# Altium schematic sheet MecaVac.SchDoc: Controle e Refrigeração de Vacinas
size A4; Author: Gabriel Canela; CompanyName: Mecatron; SheetNumber: 1; SheetTotal: 1; SPICEModelCacheDENAQWJC: <root> / <DocumentId>DENAQWJC</DocumentId> / <CacheFrame Number="0"> / <Model Name="1n4007" Kind="MDL"> / <Text>*1N4007 MCE 8-16-95 / *1000V 1A Si GenPurpose Diode pkg:DIODE0.4 1,2 / .MODEL 1N4007 D(IS=2.55E-9 RS=0.042 N=1.75 TT=5.76E-6 CJO=1.85E-11 / + VJ=0.75 M=0.333 BV=1000 IBV=9.86E-5 )</Text> / </Model> / <Model Name="fuse" Kind="CKT"> / <Text>.SUBCKT FUSE 1 2 PARAMS: CURRENT=1 RESISTANCE=1m / SW1 1 2 3 0 SMOD OFF / BNLV 3 0 V=(abs(v(1,2))) / .MODEL SMOD SW (VT={(CURRENT*RESISTANCE)} RON=1g ROFF={RESISTANCE}) / .ENDS FUSE</Text> / </Model> / </CacheFrame> / </root>
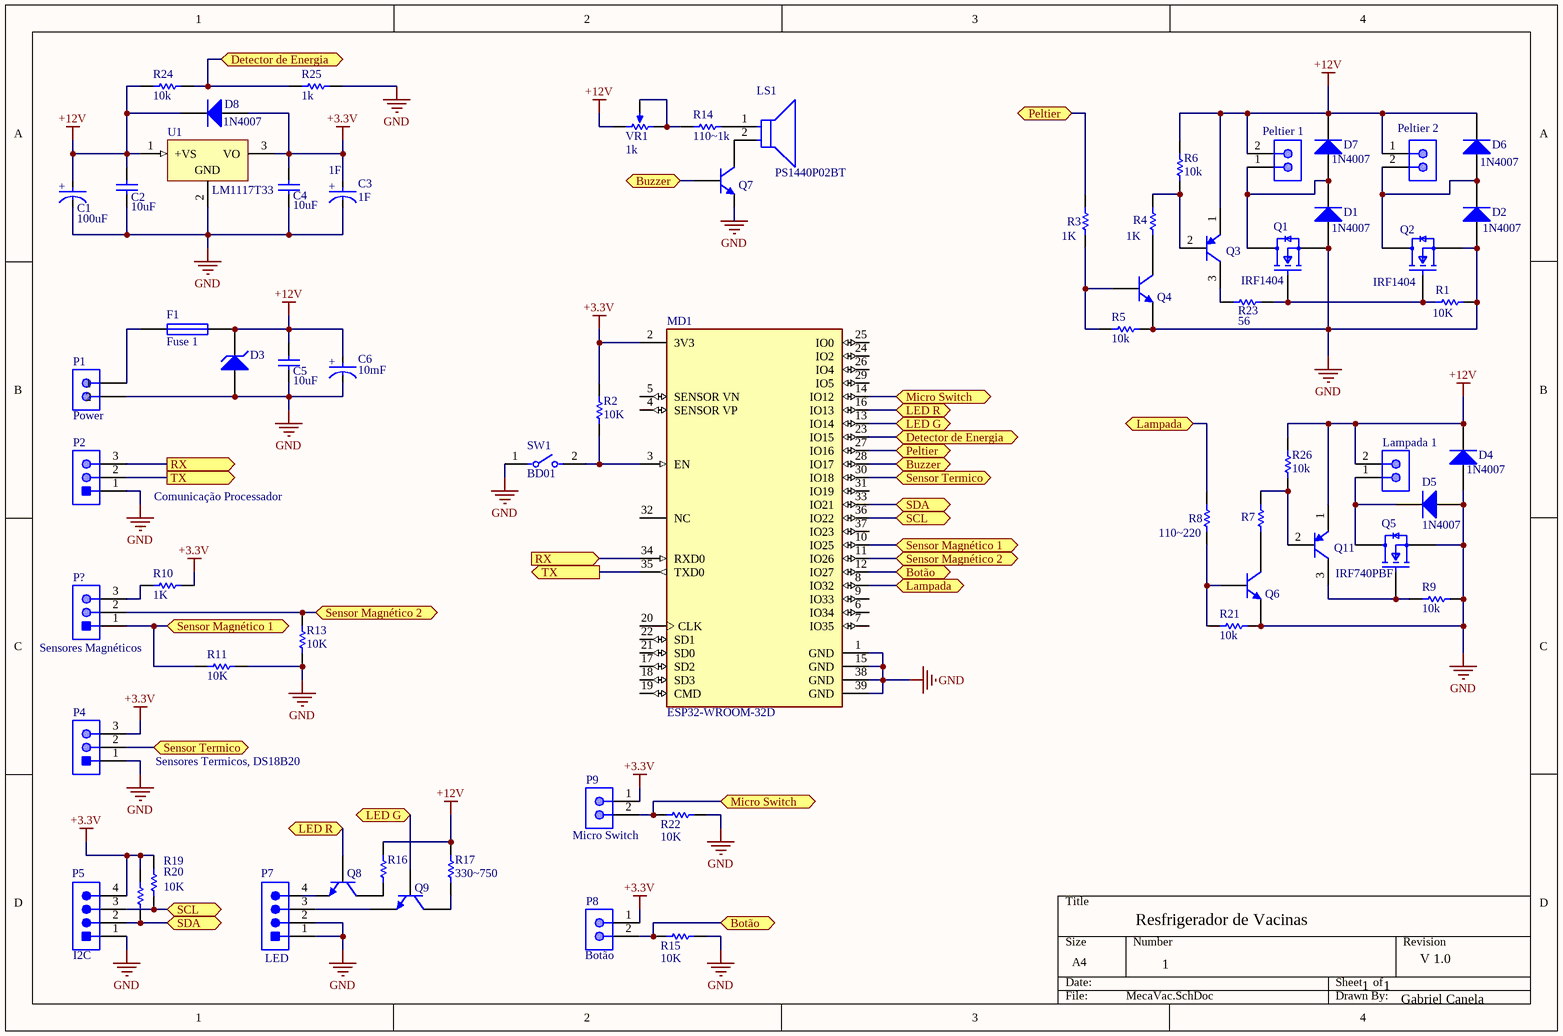
[diagram p0: MecaVac.SchDoc]

## Parts
C1  100uF  [FP-RAD-TH-D_8_0_5-L_11_5-MFG]
C2  10uF  [VISH-K104K15X7RF5TL2]
C3  1F  [FP-FR0H105ZF-MFG]
C4  10uF  [VISH-K104K15X7RF5TL2]
C5  10uF  [VISH-K104K15X7RF5TL2]
C6  10mF  [FP-RAD-TH-D_16_0_5-L_25_2-MFG]
D1  1N4007  [DO-41]
D2  1N4007  [DO-41]
D3  P6KE200A  [ONSC-SURMETIC40-2-017AA-01]  (value not drawn)
D4  1N4007  [DO-41]
D5  1N4007  [DO-41]
D6  1N4007  [DO-41]
D7  1N4007  [DO-41]
D8  1N4007  [DO-41]
F1  Fuse 1  [PIN-W2/E2.8]
Lampada_1  22-27-2021  [MOLX-22-27-2021_V]  (value not drawn)
LS1  PS1440P02BT  [FP-PS1440P02BT-MFG]
MD1  ESP32-WROOM-32D  [FP-ESP32-WROOM-32D-MFG]
P1  Power  [MOLX-22-27-2021_V]
P2  Comunicação Processador  [MOLX-22-27-2031_V]
P4  Sensores Termicos, DS18B20  [MOLX-22-27-2031_V]
P5  I2C  [MOLX-22-27-2041_V]
P7  LED  [MOLX-22-27-2041_V]
P8  Botão  [MOLX-22-27-2021_V]
P9  Micro Switch  [MOLX-22-27-2021_V]
P?  Sensores Magnéticos  [MOLX-22-27-2031_V]
Peltier_1  22-27-2021  [MOLX-22-27-2021_V]  (value not drawn)
Peltier_2  22-27-2021  [MOLX-22-27-2021_V]  (value not drawn)
Q1  IRF1404  [FP-X15-0364-MFG]
Q2  IRF1404  [FP-X15-0364-MFG]
Q3  MPSA56RLRAG  [ONSC-TO-92-3-29-11_AM_BL]  (value not drawn)
Q4  BC546BZL1G  [ONSC-TO-92-3-29-11_AM_BL]  (value not drawn)
Q5  IRF740PBF  [FP-X15-0364-MFG]
Q6  BC546BZL1G  [ONSC-TO-92-3-29-11_AM_BL]  (value not drawn)
Q7  BC546BZL1G  [ONSC-TO-92-3-29-11_AM_BL]  (value not drawn)
Q8  BC546BZL1G  [ONSC-TO-92-3-29-11_AM_BL]  (value not drawn)
Q9  BC546BZL1G  [ONSC-TO-92-3-29-11_AM_BL]  (value not drawn)
Q11  MPSA56RLRAG  [ONSC-TO-92-3-29-11_AM_BL]  (value not drawn)
R1  value 10K  [AXIAL-0.3]  (hidden comment: Res1)
R2  value 10K  [AXIAL-0.3]  (hidden comment: Res1)
R3  value 1K  [AXIAL-0.3]  (hidden comment: Res1)
R4  value 1K  [AXIAL-0.3]  (hidden comment: Res1)
R5  value 10k  [AXIAL-0.3]  (hidden comment: Res1)
R6  value 10k  [AXIAL-0.3]  (hidden comment: Res1)
R7  Res1  [AXIAL-0.3]  (value not drawn)
R8  value 110~220  [AXIAL-0.3]  (hidden comment: Res1)
R9  value 10k  [AXIAL-0.3]  (hidden comment: Res1)
R10  value 1K  [AXIAL-0.3]  (hidden comment: Res1)
R11  value 10K  [AXIAL-0.3]  (hidden comment: Res1)
R13  value 10K  [AXIAL-0.3]  (hidden comment: Res1)
R14  value 110~1k  [AXIAL-0.3]  (hidden comment: Res1)
R15  value 10K  [AXIAL-0.3]  (hidden comment: Res1)
R16  Res1  [AXIAL-0.3]  (value not drawn)
R17  value 330~750  [AXIAL-0.3]  (hidden comment: Res1)
R19  Res1  [AXIAL-0.3]  (value not drawn)
R20  value 10K  [AXIAL-0.3]  (hidden comment: Res1)
R21  value 10k  [AXIAL-0.3]  (hidden comment: Res1)
R22  value 10K  [AXIAL-0.3]  (hidden comment: Res1)
R23  value 56  [AXIAL-0.3]  (hidden comment: Res1)
R24  value 10k  [AXIAL-0.3]  (hidden comment: Res1)
R25  value 1k  [AXIAL-0.3]  (hidden comment: Res1)
R26  value 10k  [AXIAL-0.3]  (hidden comment: Res1)
SW1  BD01  [FP-BD01-MFG]
U1  LM1117T33  [NEB0003A]
VR1  1k  [BOUR-3362P]

## Ports
Botão (bidir, see MecaVac[2D]), Botão (bidir, see MecaVac[3C]), Buzzer (bidir, see MecaVac[2A]), Buzzer (bidir, see MecaVac[3B]), Detector de Energia (bidir, see MecaVac[1A]), Detector de Energia (bidir, see MecaVac[3B]), Lampada (bidir, see MecaVac[3B]), Lampada (bidir, see MecaVac[3C]), LED G (bidir, see MecaVac[1D]), LED G (bidir, see MecaVac[3B]), LED R (bidir, see MecaVac[1D]), LED R (bidir, see MecaVac[3B]), Micro Switch (bidir, see MecaVac[2D]), Micro Switch (bidir, see MecaVac[3B]), Peltier (bidir, see MecaVac[3A]), Peltier (bidir, see MecaVac[3B]), RX (in, see MecaVac[1B]), RX (out, see MecaVac[2C]), SCL (bidir, see MecaVac[1D]), SCL (bidir, see MecaVac[3C]), SDA (bidir, see MecaVac[1D]), SDA (bidir, see MecaVac[3B]), Sensor Magnético 1 (bidir, see MecaVac[1C]), Sensor Magnético 1 (bidir, see MecaVac[3C]), Sensor Magnético 2 (bidir, see MecaVac[1C]), Sensor Magnético 2 (bidir, see MecaVac[3C]), Sensor Termico (bidir, see MecaVac[1C]), Sensor Termico (bidir, see MecaVac[3B]), TX (out, see MecaVac[1B]), TX (out, see MecaVac[2C])

## Nets
+3.3V: C3.2(A) C4.2 D8.1(A) MD1.2(3V3) P4.3 P5.4 P8.1 P9.1 R2.2 R10.1 R19.2 R20.2 U1.3(VO)
+12V: C1.2(A) C2.2 C5.2 C6.2(A) D3.1(K) D4.2(K) D6.2(K) D7.2(K) D8.2(K) F1.1 Lampada_1.2 Peltier_1.2 Peltier_2.1 Q3.1(E) Q11.1(E) R6.2 R16.1 R17.1 R24.2 R26.2 U1.1(+VS) VR1.3(CW)
GND: C1.1(C) C2.1 C3.1(C) C4.1 C5.1 C6.1(C) D1.1(A) D2.1(A) D3.2(A) D4.1(A) D5.1(A) MD1.1(GND) MD1.15(GND) MD1.38(GND) MD1.39(GND) P1.2 P2.1 P4.1 P5.1 P7.1 P7.2 Q1.3(S) Q2.3(S) Q4.3(E) Q5.3(S) Q6.3(E) Q7.3(E) R1.2 R5.2 R9.1 R11.1 R13.2 R15.1 R21.2 R22.1 R25.1 SW1.1 U1.2(GND)
Botão: MD1.12(IO27) P8.2 R15.2 ; port Botão
Buzzer: MD1.28(IO17) Q7.2(B) ; port Buzzer
Detector de Energia: MD1.23(IO15) R24.1 R25.2 ; port Detector de Energia
Lampada: MD1.8(IO32) R8.2 ; port Lampada
LED G: MD1.13(IO14) Q9.2(B) ; port LED G
LED R: MD1.16(IO13) Q8.2(B) ; port LED R
Micro Switch: MD1.14(IO12) P9.2 R22.2 ; port Micro Switch
Peltier: MD1.27(IO16) R3.2 ; port Peltier
RX: MD1.34(RXD0) P2.3 ; port RX
SCL: MD1.36(IO22) P5.3 R20.1 ; port SCL
SDA: MD1.33(IO21) P5.2 R19.1 ; port SDA
Sensor Magnético 1: MD1.10(IO25) P?.1 R11.2 ; port Sensor Magnético 1
Sensor Magnético 2: MD1.11(IO26) P?.2 R13.1 ; port Sensor Magnético 2
Sensor Termico: MD1.30(IO18) P4.2 ; port Sensor Termico
TX: MD1.35(TXD0) P2.2 ; port TX
NetD1_2: D1.2(K) D7.1(A) Peltier_1.1 Q1.2(D)
NetD2_2: D2.2(K) D6.1(A) Peltier_2.2 Q2.2(D)
NetD5_2: D5.2(K) Lampada_1.1 Q5.2(D)
NetF1_2: F1.2 P1.1
NetLS1_1: LS1.1 R14.1
NetLS1_2: LS1.2 Q7.1(C)
NetMD1_3: MD1.3(EN) R2.1 SW1.2
NetP7_3: P7.3 Q9.3(E)
NetP7_4: P7.4 Q8.3(E)
NetP?_3: P?.3 R10.2
NetQ1_1: Q1.1(G) Q2.1(G) R1.1 R23.2
NetQ3_2: Q3.2(B) R4.2 R6.1
NetQ3_3: Q3.3(C) R23.1
NetQ4_1: Q4.1(C) R4.1
NetQ4_2: Q4.2(B) R3.1 R5.1
NetQ5_1: Q5.1(G) Q11.3(C) R9.2
NetQ6_1: Q6.1(C) R7.1
NetQ6_2: Q6.2(B) R8.1 R21.1
NetQ8_1: Q8.1(C) R16.2
NetQ9_1: Q9.1(C) R17.2
NetQ11_2: Q11.2(B) R7.2 R26.1
NetR14_2: R14.2 VR1.1(CCW) VR1.2(S)

Not connected (* = marked no-connect by the designer): MD1 4(SENSOR_VP) 5(SENSOR_VN) 6(IO34) 7(IO35) 9(IO33) 17(SD2) 18(SD3) 19(CMD) 20(CLK) 21(SD0) 22(SD1) 24(IO2) 25(IO0) 26(IO4) 29(IO5) 31(IO19) 32(NC) 37(IO23)

## Notes on the sheet
- Resfrigerador de Vacinas
- 1
- V 1.0
- Gabriel Canela
- (in symbol CMP-03024-000003-1) +
- (in symbol CMP-05427-001264-1) +
- (in symbol CMP-05427-001523-1) +

## Library data of the parts
C1 = CMP-05427-001264-1: Aluminum Electrolytic Capacitors (Radial Lead Type) AEC-Q200 Qualified 120uF ±20% 35V; Lead Diameter: 0.6mm; Leakage Current: 3uA; Polarity: Polar; Ripple Current: 555mA; Life (Hours): 2000Hour; Tolerance: 10%; Impedance: 117mR; Height - Seated (Max): 0.453inch; Max Operating Temperature: 105°C; REACH SVHC: No SVHC; Construction: RADIAL; Diameter: 8mm; Length: 11.5mm; Capacitance: 120uF; Contact Plating: Tin; Min Operating Temperature: -55°C; Height: 11.5mm; Package Quantity: 200; Termination: Radial; Voltage Rating: 35V; Voltage Rating (DC): 35V; Lead Free: Lead Free; Case/Package: Radial; Packaging: Bulk; Radiation Hardening: No; Voltage: 35V; ESR (Equivalent Series Resistance): 117mR; Number of Pins: 2; Series: FC; RoHS Compliant: Yes; Mount: Through Hole; Lead Pitch: 3.5mm; Ripple Current (AC): 555mA
C2 C4 C5 = CMP-2000-06508-1: Ceramic Capacitor, 100 nF, +/- 10%, 50 V, -55 to 125 degC, 2-Pin THD, RoHS, Tape and Reel; Manufacturer: Vishay; Other Names: BC1084CT; Catalog Drawings: Mono-KapSide2-15_5.58Mono-KapSide1_15; Temperature Coefficient: X7R; Voltage - Rated: 50V; Online Catalog: Mono-Kap™Series; Capacitance: 0.1µF; Size / Dimension: 0.157"Lx0.098"W(4.00mmx2.50mm); Operating Temperature: -55°C~125°C; Family: CeramicCapacitors; Manufacturer URL: http://www.vishay.com/; Standard Package: 1; Thickness (Max): -; Ratings: -; Datasheet Version: 08/2013; Package Description: 2-Pin Through Hole Device, Body 4 x 2.6 mm; Mounting Type: ThroughHole; Features: -; Lead Spacing: 0.098"(2.50mm); Tolerance: ±10%; Category: Capacitors; Mounting Technology: ThroughHole; Lead Style: Straight; Datasheet URL: http://www.vishay.com/docs/45171/kseries.pdf; Applications: GeneralPurpose; Package / Case: Radial; Height - Seated (Max): 0.220"(5.58mm); Package Reference: K104K15X7RF5TL2; Series: Mono-Kap™K; Packaging: CutTape(CT)
C3 = CMP-03024-000003-1: CAP 1F -20% +80% 5.5V T/H; Manufacturer: KEMET; Manufacturer Part Number: FR0H105ZF; Tolerance: -20/+80%; Digikey Description: CAP 1F -20% +80% 5.5V T/H; Device Class L1: Passive Components; Device Class L3: Supercapacitors; ComponentLink2URL: https://content.kemet.com/datasheets/KEM_S6016_FR.pdf; Value: 1F; RoHS: TRUE; Mouser Description: Supercapacitors / Ultracapacitors 1F 5.5volts Radial Super Cap; Octopart: https://octopart.com/fr0h105zf-kemet-30531656; Voltage Rating: 5.5V; Device Class L2: Capacitors; Package: FR0H105ZF; Temperature: -40°C to +85°C; Temperature Range High: +85°C; Automotive: No; Capacitance: 1F; Temperature Range Low: -40°C; ComponentLink2Description: Datasheet; Category: Cap; Height: 22mm; Lead Free: Yes
C6 = CMP-05427-001523-1: Aluminum Electrolytic Capacitors (Radial Lead Type) AEC-Q200 Qualified 10000uF ±20% 10V; Lead Diameter: 0.8mm; Life (Hours): 2000Hour; Lead/Base Style: Straight; Ripple Current: 1.89A; Voltage Rating: 10V; Series: HD; Case/Package: Radial; Max Operating Temperature: 105°C; Tolerance: 20%; Construction: RADIAL; REACH SVHC: No SVHC; Lead Pitch: 7.5mm; Voltage Rating (DC): 10V; RoHS Compliant: Yes; Packaging: Bulk; Voltage: 10V; Height: 25mm; Termination: Radial; Ripple Current (AC): 1.89A; Min Operating Temperature: -55°C; Diameter: 16mm; Height - Seated (Max): 1.063inch; Capacitance: 10mF; Length: 25mm; Package Quantity: 100; Mount: Through Hole
D1 D2 D4-D8 = Diode 1N4007: 1 Amp General Purpose Rectifier; Published: 8-Jun-2000; LatestRevisionDate: 17-Jul-2002; LatestRevisionNote: Re-released for DXP Platform.; DatasheetVersion: 1998; PackageVersion: Aug-1999; PackageReference: DO-41; Publisher: Altium Limited; PackageDescription: Diode, Axial; Body 5.2 x 2.7 mm (LxDia. max), Lead Dia. 0.86 mm (max); Code_JEDEC: DO-204-AL; ComponentLink1Description: Manufacturer Link; ComponentLink1URL: http://www.fairchildsemi.com/; ComponentLink2Description: Datasheet; ComponentLink2URL: http://www.fairchildsemi.com/ds/1N%2F1N4001.pdf
D3 = CMP-1061-00677-1: 600 W Peak Power Transient Voltage Suppressor, 2-Pin Surmetic(TM) 40, Bulk Box; Manufacturer: On Semiconductor; IR Max (uA): 5; V(BR) Typ (V): 200; Direction: Unidirectional; PPK Max (W): 600; ComponentLink3URL: http://www.onsemi.cn/pub_link/Collateral/017AA.PDF; PackageReference: SURMETIC40-2-017AA-01; ComponentLink1Description: Manufacturer URL; ComponentLink2URL: http://www.onsemi.com/pub_link/Collateral/P6KE6.8A-D.PDF; ComponentLink1URL: http://www.onsemi.com/; PackageDescription: 2-Pin, Axial Lead, Diameter 3.49 mm; DatasheetVersion: Rev. 10; PackageVersion: Rev. O, 09/2005; PartNumber: P6KE200A; ComponentLink3Description: Package Specification; ComponentLink2Description: Datasheet; Mounting Technology: Through Hole; Packing: Bulk Box
F1 = Fuse 1: Fuse; Published: 8-Jun-2000; LatestRevisionDate: 17-Jul-2002; LatestRevisionNote: Re-released for DXP Platform.; PackageReference: PIN-W2/E2.8; Publisher: Altium Limited; PackageDescription: Thru-Hole; 2 Leads
Lampada_1 P1 P8 P9 Peltier_1 Peltier_2 = CMP-2000-05537-1: Male Header, Pitch 2.54 mm, 1 x 2 Position, Height 11.7 mm, Tail Length 3.56 mm, 0 to 75 degC, RoHS, Bulk; Manufacturer: Molex; PartNumber: 0022272021; Current rating: 4A; Package Version: Rev. BC, 02/2012; Voltage rating: 250V; No. of Positions: 2; Pitch: 2.54mm; No. of Rows: 1; Orientation: Vertical; Operating temperature: 0°Cto+75°C; Manufacturer URL: http://www.molex.com/; Mounting Technology: ThroughHole; Housing material: Nylon(UL94V-0); Package Description: 2-Leads Header, Body 5.08 x 5.8 mm, Pitch 2.54 mm; Voltage - Max: 250V; Datasheet URL: http://www.molex.com/pdm_docs/sd/022272021_sd.pdf; Package Reference: 22-27-2021; Contact material: Tinplatedbrass; Current - Max: 4A; Datasheet Version: Rev. F, 06/2009
LS1 = CMP-08413-000003-1: AUDIO PIEZO TRANSDUCER 30V TH; Self Resonant Frequency: 4kHz; Washable: No; Voltage Rating (DC): 3V; Number of Terminals/Pins: 2; Packaging: Tape and Reel; Lead Free: Lead Free; Min Operating Temperature: -10°C; Package Quantity: 350; Termination: PC Pins; Mount: Through Hole; Max Operating Temperature: 70°C; Operating Supply Voltage: 3V; Diameter: 14mm; RoHS Compliant: Yes; Frequency: 4kHz; Height: 8mm
MD1 = CMP-194065-000003-1: WIFI MODULE 32MBITS SPI FLASH; Manufacturer: Espressif Systems; Max Supply Voltage: 3.6V; Nominal Supply Current: 500mA; Max Frequency: 2484MHz; Number Of Adc Channels: 16; Number Of Gpio: 32; Interface: I2C,SPI,UART,Ethernet,I2S,Other; Data Rate: 150Mbits/s; Min Supply Voltage: 3V; Bandwidth: 72MHz; Sensitivity: -98dBm; Octopart: https://octopart.com/esp32-wroom-32d-espressif+systems-91040050; Package: ESP32-WROOM-32D; ComponentLink2URL: https://www.espressif.com/sites/default/files/documentation/esp32-wroom-32d_esp32-wroom-32u_datasheet_en.pdf; Lead Free: Yes; Category: UNK; Mouser Description: Wi-Fi/BT BLE Module ESP32-D0WD, SPI Flash, UART, P; Device Class L1: Integrated Circuits (ICs); RoHS: TRUE; Temperature Range Low: -40°C; ComponentLink2Description: Datasheet; Digikey Description: WIFI MODULE 32MBITS SPI FLASH; Height: 3.2mm; Temperature: -40°C to +85°C; Manufacturer Part Number: ESP32-WROOM-32D; Device Class L3: Transceivers; Device Class L2: RF Semiconductors and Devices; Temperature Range High: +85°C; Automotive: No
P2 P4 P? = CMP-2000-05538-1: Male Header, Pitch 2.54 mm, 1 x 3 Position, Height 11.7 mm, Tail Length 3.56 mm, -40 to 80 degC, RoHS, Bulk; Manufacturer: Molex; Voltage rating: 250V; Current rating: 4A; Package Reference: 22-27-2031; Housing material: Nylon(UL94V-0); Operating temperature: 0°Cto+75°C; Package Description: Male Header, Pitch 2.54 mm, 1 x 3 Position, Height 11.7 mm, Tail Length 3.56 mm; Package URL: http://www.molex.com/pdm_docs/sd/022272031_sd.pdf; Datasheet Version: 06/2016; Manufacturer URL: http://www.molex.com/; Mounting Technology: ThroughHole; Datasheet URL: http://www.molex.com/webdocs/datasheets/pdf/en-us/0022272031_PCB_HEADERS.pdf; Contact material: Tinplatedbrass
P5 P7 = CMP-2000-05243-1: Male Header, Pitch 2.54 mm, 1 x 4 Position, Height 11.7 mm, Tail Length 3.56 mm, RoHS, Bulk; Manufacturer: Molex; Voltage rating: 250V; Current rating: 4A; Datasheet Version: Rev. F, 06/2009; Operating temperature: 0degCto+75degC; Contact material: Tinplatedbrass; Manufacturer URL: http://www.molex.com/; Housing material: Nylon(UL94V-0); Datasheet URL: http://www.molex.com/pdm_docs/sd/022272041_sd.pdf
Q1 Q2 = CMP-02550-000088-1: MOSFET N-CH 400V 10A TO-220AB; Manufacturer Part Number: IRF740PBF; Manufacturer: Vishay; Power Dissipation: 125W; Turn On Delay Time: 14ns; Standoff Height: 3.33mm; Max Junction Temp: +150°C; Number Of Channels: 1; Reverse Recovery Charge: 3800nC; Turn Off Delay Time: 50ns; Threshold Vgs Min: 2V; Input Capacitace At Vds: 1400pF @ 25V; Depletion Mode: False; Gate Charge At Vgs: 63nC @ 10V; Rthja Max: 62°C/W; Threshold Vgs Max: 4V; Gate To Source Voltage: 20V; Pulse Drain Current: 40A; Reverse Recovery Time: 370ns; Drain To Source Resistance: 0.55Ω; Temperature Range Low: -55°C; Mouser Description: MOSFET N-Chan 400V 10 Amp; Package: X15-0364; RoHS: TRUE; Category: Trans; Drain To Source Voltage: 400V; Drain To Source Breakdown Voltage: 400V; Device Class L3: MOSFETs; Lead Free: Yes; Height: 19.89mm; Continuous Drain Current: 10A; Octopart: https://octopart.com/irf740pbf-vishay-46527100; Automotive: No; Max Forward Diode Voltage: 2V; Device Class L1: Discrete Semiconductors; ComponentLink2URL: http://www.vishay.com/docs/91054/91054.pdf; Temperature Range High: +150°C; Device Class L2: Transistors; ComponentLink2Description: Datasheet; Temperature: -55°C to +150°C; Number Of N Channels: 1; Digikey Description: MOSFET N-CH 400V 10A TO-220AB
Q3 Q11 = CMP-1048-01494-1: 80 V, 0.5 A, Amplifier Transistor, PNP Transistor, 3-Pin TO-92, Pb-Free, Tape and Reel; Manufacturer: On Semiconductor; fT Min (MHz): 50; IC Continuous (A): 0.5; ComponentLink2Description: Datasheet; Polarity: PNP; Packing: Tape and Reel; Mounting Technology: Through Hole; DatasheetVersion: Rev. 3; ComponentLink1Description: Manufacturer URL; ComponentLink1URL: http://www.onsemi.com/; RoHS: TRUE; PackageVersion: Rev. AM; PackageDescription: 3-Pin Transistor Outline, Body 4.825 x 3.685 mm, Pitch 1.27 mm; PartNumber: MPSA56RLRAG; ComponentLink3Description: Package Specification; ComponentLink3URL: http://www.onsemi.com/pub_link/Collateral/MAC97-D.PDF; PackageReference: TO-92-3-29-11_AM_BL; ComponentLink2URL: http://www.onsemi.cn/pub_link/Collateral/MPSA05-D.PDF
Q4 Q6-Q9 = CMP-1048-01594-1: Amplifier Transistor, NPN Silicon, 3-Pin TO-92, Pb-Free, Ammo Box; Manufacturer: On Semiconductor; IC Continuous (A): 0.1; fT Min (MHz): 150; PartNumber: BC546BZL1G; PackageVersion: Rev. AM; ComponentLink2Description: Datasheet; Packing: Ammo Box; ComponentLink1URL: http://www.onsemi.com/; ComponentLink3Description: Package Specification; ComponentLink2URL: http://www.onsemi.com/pub_link/Collateral/BC546-D.PDF; Mounting Technology: Through Hole; DatasheetVersion: Rev. 7; RoHS: TRUE; Polarity: NPN; ComponentLink1Description: Manufacturer URL; ComponentLink3URL: http://www.onsemi.com/pub_link/Collateral/MAC97-D.PDF; PackageDescription: 3-Pin Transistor Outline, Body 4.825 x 3.685 mm, Pitch 1.27 mm; PackageReference: TO-92-3-29-11_AM_BL
Q5 = CMP-02550-000088-1: MOSFET N-CH 400V 10A TO-220AB; Manufacturer: Vishay; Power Dissipation: 125W; Turn On Delay Time: 14ns; Standoff Height: 3.33mm; Max Junction Temp: +150°C; Number Of Channels: 1; Reverse Recovery Charge: 3800nC; Turn Off Delay Time: 50ns; Threshold Vgs Min: 2V; Input Capacitace At Vds: 1400pF @ 25V; Depletion Mode: False; Gate Charge At Vgs: 63nC @ 10V; Rthja Max: 62°C/W; Threshold Vgs Max: 4V; Gate To Source Voltage: 20V; Pulse Drain Current: 40A; Reverse Recovery Time: 370ns; Drain To Source Resistance: 0.55Ω; Temperature Range Low: -55°C; Mouser Description: MOSFET N-Chan 400V 10 Amp; Package: X15-0364; RoHS: TRUE; Manufacturer Part Number: IRF740PBF; Category: Trans; Drain To Source Voltage: 400V; Drain To Source Breakdown Voltage: 400V; Device Class L3: MOSFETs; Lead Free: Yes; Height: 19.89mm; Continuous Drain Current: 10A; Octopart: https://octopart.com/irf740pbf-vishay-46527100; Automotive: No; Max Forward Diode Voltage: 2V; Device Class L1: Discrete Semiconductors; ComponentLink2URL: http://www.vishay.com/docs/91054/91054.pdf; Temperature Range High: +150°C; Device Class L2: Transistors; ComponentLink2Description: Datasheet; Temperature: -55°C to +150°C; Number Of N Channels: 1; Digikey Description: MOSFET N-CH 400V 10A TO-220AB
R1-R6 R8-R11 R13-R15 R17 R20-R26 = Res1: Resistor; Published: 8-Jun-2000; LatestRevisionDate: 17-Jul-2002; LatestRevisionNote: Re-released for DXP Platform.; PackageReference: AXIAL-0.3; Publisher: Altium Limited; PackageDescription: Axial Device, Thru-Hole; 2 Leads; 0.3 in Pin Spacing
R7 = Res1: Resistor; Value: 110~220; Published: 8-Jun-2000; LatestRevisionDate: 17-Jul-2002; LatestRevisionNote: Re-released for DXP Platform.; PackageReference: AXIAL-0.3; Publisher: Altium Limited; PackageDescription: Axial Device, Thru-Hole; 2 Leads; 0.3 in Pin Spacing
R16 = Res1: Resistor; Value: 330~750; Published: 8-Jun-2000; LatestRevisionDate: 17-Jul-2002; LatestRevisionNote: Re-released for DXP Platform.; PackageReference: AXIAL-0.3; Publisher: Altium Limited; PackageDescription: Axial Device, Thru-Hole; 2 Leads; 0.3 in Pin Spacing
R19 = Res1: Resistor; Value: 10K; Published: 8-Jun-2000; LatestRevisionDate: 17-Jul-2002; LatestRevisionNote: Re-released for DXP Platform.; PackageReference: AXIAL-0.3; Publisher: Altium Limited; PackageDescription: Axial Device, Thru-Hole; 2 Leads; 0.3 in Pin Spacing
SW1 = CMP-10033-000004-1: SWITCH SLIDE DIP SPST 100MA 5V; Max Voltage Rating (DC): 25V; Contact Current Rating: 25mA; Pitch: 0.1inch; Number of Circuits: 1; Actuator Material: Nylon; Life (Cycles): 10000Cycles; Body Material: PBT; Approvals: UL; Actuator Type: Slide (Standard); Washable: Yes; Actuator Length: 0.9mm; Capacitance: 5pF; Length: 0.18inch; Lead Free: Lead Free; Material: Nylon; Termination: PC Pin; Orientation: Straight; Throw Configuration: SPST; Case/Package: DIP; Package Quantity: 115; Packaging: Rail/Tube; Number of Positions: 1; Max Operating Temperature: 85°C; Terminal Pitch: 2.54mm; Mount: Through Hole; Min Operating Temperature: -40°C; RoHS Compliant: Yes; Depth: 9.65mm; Electrical Life: 10000Cycles; Series: BD; Contact Material: Bronze; Max Current Rating: 100mA; Current Rating: 100mA; Mechanical Life: 10000Cycles; Number of Poles: 1; REACH SVHC: No SVHC; Contact Plating: Gold; Radiation Hardening: No; Width: 9.65mm; Voltage Rating (DC): 5V
U1 = CMP-0066-00347-4: Precision Centigrade Temperature Sensor, 3-pin TO-220; Manufacturer: Texas Instruments; PowerWise: N; CompType: Temp Sensor IC; PackageTopMarking: NSUZXYTTE#*LM35DT; PackageReference: NEB0003A; Code_JEDEC: TO-220-AB; ComponentLink1URL: http://www.ti.com/general/docs/lit/getliterature.tsp?genericPartNumber=LM35&fileType=pdf; ComponentLink1Description: Datasheet URL; PackageDescription: TO-220, Molded, 3 Lead, Auto L/F; RoHS: N; PinCount: 3
VR1 = CMP-1747-00003-1: Square Trimpot(R) Trimming Potentiometer, 100 KOhm, 300 V, -55 to 125 degC, 3-Pin THD, RoHS, Tube; Voltage Rating: 250 V; Case\Package: Axial; Tolerance: 1%; Power Rating: 250 mW; Resistance: 1 mohm; RoHSCompliant: true; ComponentLink2URL: http://www.bourns.com/docs/Product-Datasheets/3362.pdf; ComponentLink1Description: Manufacturer URL; DatasheetVersion: May-16; Package Quantity: 200; ComponentLink2Description: Datasheet; Min Operating Temperature: -55 degC; Mount: Through Hole; PackageDescription: 3-Pin Through Hole Device, Body 6.6 x 6.99 mm, Pitch 2.54 mm; Length: 0.248 inch; ComponentLink1URL: http://www.bourns.com/; PackageReference: 3326P; Max Operating Temperature: 155 degC; Packaging: Bulk